# EAGLE design hendrikson_1_1 (EAGLE 8.4.3)
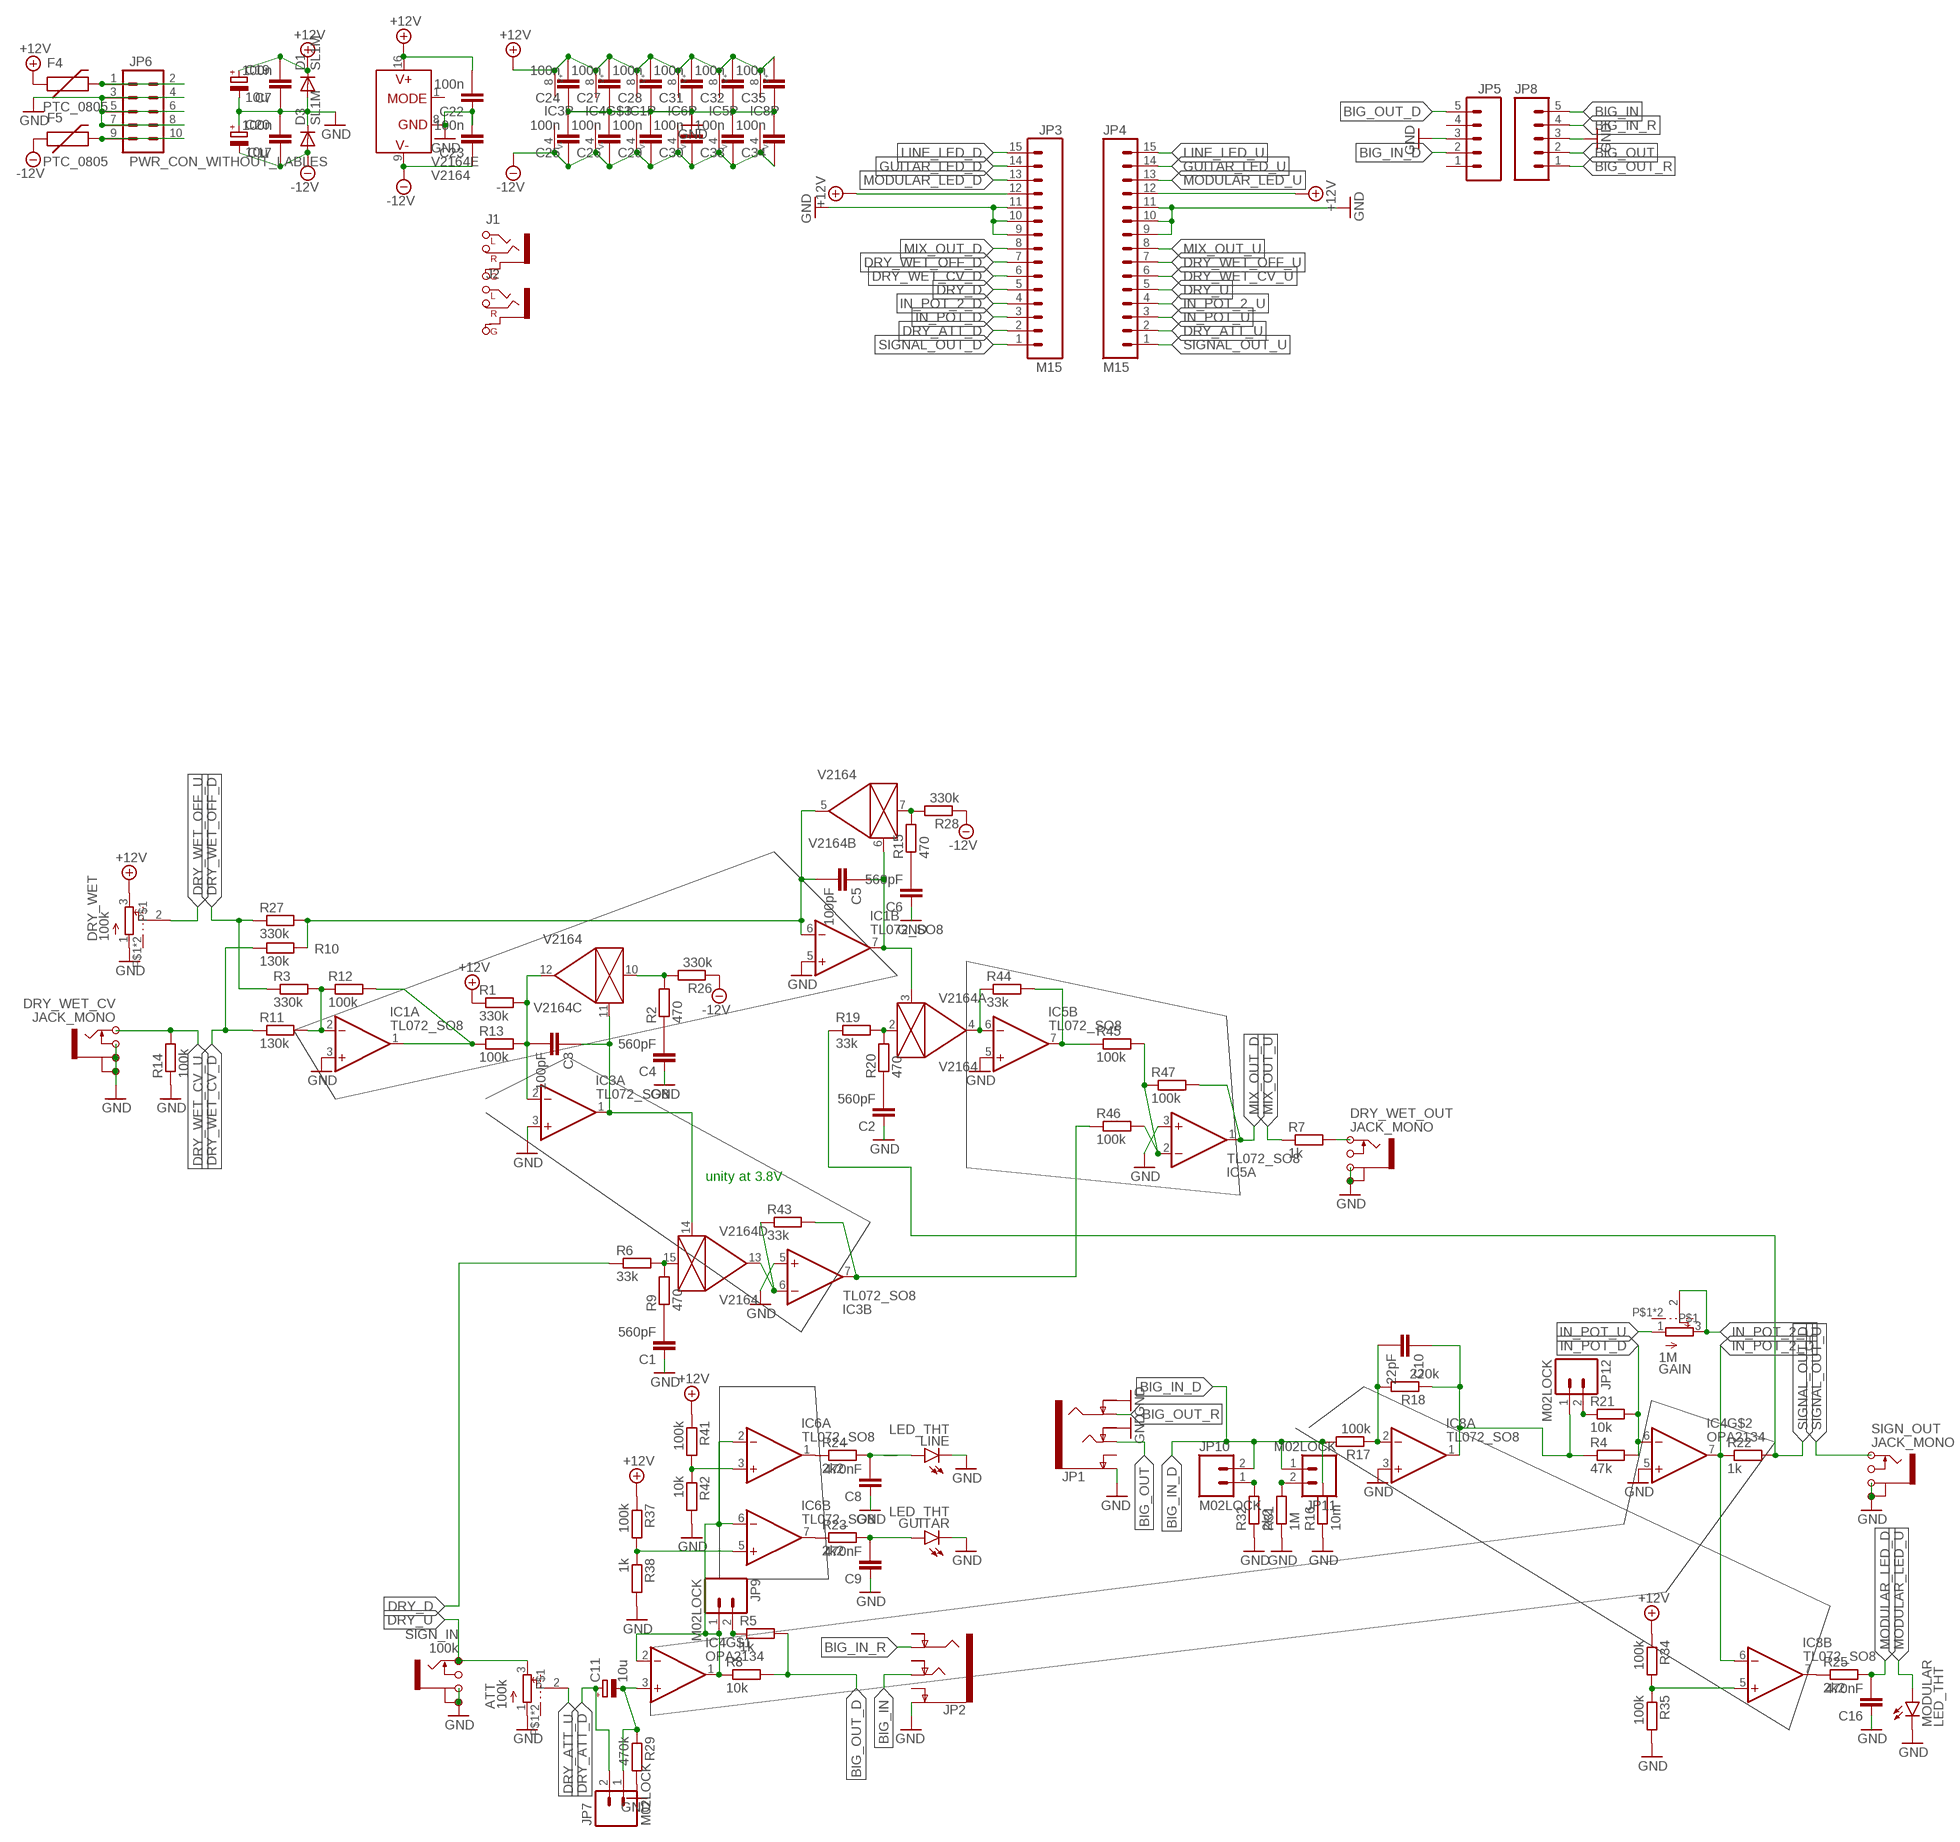
[diagram p0: schematic, sheet 1]

## Parts
ATT  100k  POT_ALPHA  [POT_ALPHA]
C1  560pF  CAPACITOR0603  [CAPACITOR0603]
C2  560pF  CAPACITOR0603  [CAPACITOR0603]
C3  100pF  CAPACITOR0603  [CAPACITOR0603]
C4  560pF  CAPACITOR0603  [CAPACITOR0603]
C5  100pF  CAPACITOR0603  [CAPACITOR0603]
C6  560pF  CAPACITOR0603  [CAPACITOR0603]
C7  100n  CAPACITOR0603  [CAPACITOR0603]
C8  470nF  CAPACITOR0603  [CAPACITOR0603]
C9  470nF  CAPACITOR0603  [CAPACITOR0603]
C10  22pF  CAPACITOR0603  [CAPACITOR0603]
C11  10u  CPOL_4MM  [CPOL_4MM]
C16  470nF  CAPACITOR0603  [CAPACITOR0603]
C17  100n  CAPACITOR0603  [CAPACITOR0603]
C19  10u  CPOL_4MM  [CPOL_4MM]
C20  10u  CPOL_4MM  [CPOL_4MM]
C22  100n  CAPACITOR0603  [CAPACITOR0603]
C23  100n  CAPACITOR0603  [CAPACITOR0603]
C24  100n  CAPACITOR0603  [CAPACITOR0603]
C25  100n  CAPACITOR0603  [CAPACITOR0603]
C26  100n  CAPACITOR0603  [CAPACITOR0603]
C27  100n  CAPACITOR0603  [CAPACITOR0603]
C28  100n  CAPACITOR0603  [CAPACITOR0603]
C29  100n  CAPACITOR0603  [CAPACITOR0603]
C30  100n  CAPACITOR0603  [CAPACITOR0603]
C31  100n  CAPACITOR0603  [CAPACITOR0603]
C32  100n  CAPACITOR0603  [CAPACITOR0603]
C33  100n  CAPACITOR0603  [CAPACITOR0603]
C34  100n  CAPACITOR0603  [CAPACITOR0603]
C35  100n  CAPACITOR0603  [CAPACITOR0603]
D1  SL1M  [SOD123]
D3  SL1M  [SOD123]
DRY_WET  100k  POT_ALPHA  [POT_ALPHA]
DRY_WET_CV  JACK_MONO  [JACK_MONO]
DRY_WET_OUT  JACK_MONO  [JACK_MONO]
F4  PTC_0805  [PTC0805]
F5  PTC_0805  [PTC0805]
GAIN  1M  POT_ALPHA  [POT_ALPHA]
GUITAR  LED_THT  [LEDSMALLHOLES]
IC1  TL072_SO8  [SO8]
IC3  TL072_SO8  [SO8]
IC4  OPA2134  [SO8]
IC5  TL072_SO8  [SO8]
IC6  TL072_SO8  [SO8]
IC8  TL072_SO8  [SO8]
J1  NEUTRIK_VERT_JACK_6.3MM  [RJ5VM]
J2  NEUTRIK_VERT_JACK_6.3MM  [RJ5VM]
JP1  SPARKFUN-CONNECTORS_AUDIO-JACK4-.25-HORIZ-TRS  [SPARKFUN-CONNECTORS_AUDIO-JACK-.25-INCH-HORIZ-PTH]
JP2  SPARKFUN-CONNECTORS_AUDIO-JACK4-.25-HORIZ-TRS  [SPARKFUN-CONNECTORS_AUDIO-JACK-.25-INCH-HORIZ-PTH]
JP3  M15  [1X15]
JP4  M15  [1X15]
JP5  M05PTH  [1X05]
JP6  PWR_CON_WITHOUT_LABLES  [PWR_CON_WITHOUT_LABLES]
JP7  M02LOCK  [1X02_LOCK]
JP8  M05PTH_LONGPADS  [1X05_LONGPADS]
JP9  M02LOCK  [1X02_LOCK]
JP10  M02LOCK  [1X02_LOCK]
JP11  M02LOCK  [1X02_LOCK]
JP12  M02LOCK  [1X02_LOCK]
LINE  LED_THT  [LEDSMALLHOLES]
MODULAR  LED_THT  [LEDSMALLHOLES]
R1  330k  RESISTOR0603  [RESISTOR0603]
R2  470  RESISTOR0603  [RESISTOR0603]
R3  330k  RESISTOR0603  [RESISTOR0603]
R4  47k  RESISTOR0603  [RESISTOR0603]
R5  1k  RESISTOR0603  [RESISTOR0603]
R6  33k  RESISTOR0603  [RESISTOR0603]
R7  1k  RESISTOR0603  [RESISTOR0603]
R8  10k  RESISTOR0603  [RESISTOR0603]
R9  470  RESISTOR0603  [RESISTOR0603]
R10  130k  RESISTOR0603  [RESISTOR0603]
R11  130k  RESISTOR0603  [RESISTOR0603]
R12  100k  RESISTOR0603  [RESISTOR0603]
R13  100k  RESISTOR0603  [RESISTOR0603]
R14  100k  RESISTOR0603  [RESISTOR0603]
R15  470  RESISTOR0603  [RESISTOR0603]
R16  10m  RESISTOR0603  [RESISTOR0603]
R17  100k  RESISTOR0603  [RESISTOR0603]
R18  220k  RESISTOR0603  [RESISTOR0603]
R19  33k  RESISTOR0603  [RESISTOR0603]
R20  470  RESISTOR0603  [RESISTOR0603]
R21  10k  RESISTOR0603  [RESISTOR0603]
R22  1k  RESISTOR0603  [RESISTOR0603]
R23  2k2  RESISTOR0603  [RESISTOR0603]
R24  2k2  RESISTOR0603  [RESISTOR0603]
R25  2k2  RESISTOR0603  [RESISTOR0603]
R26  330k  RESISTOR0603  [RESISTOR0603]
R27  330k  RESISTOR0603  [RESISTOR0603]
R28  330k  RESISTOR0603  [RESISTOR0603]
R29  470k  RESISTOR0603  [RESISTOR0603]
R31  1M  RESISTOR0603  [RESISTOR0603]
R32  2k2  RESISTOR0603  [RESISTOR0603]
R34  100k  RESISTOR0603  [RESISTOR0603]
R35  100k  RESISTOR0603  [RESISTOR0603]
R37  100k  RESISTOR0603  [RESISTOR0603]
R38  1k  RESISTOR0603  [RESISTOR0603]
R41  100k  RESISTOR0603  [RESISTOR0603]
R42  10k  RESISTOR0603  [RESISTOR0603]
R43  33k  RESISTOR0603  [RESISTOR0603]
R44  33k  RESISTOR0603  [RESISTOR0603]
R45  100k  RESISTOR0603  [RESISTOR0603]
R46  100k  RESISTOR0603  [RESISTOR0603]
R47  100k  RESISTOR0603  [RESISTOR0603]
SIGN_IN  100k  JACK_MONO  [JACK_MONO]
SIGN_OUT  JACK_MONO  [JACK_MONO]
V2164  V2164  SSM2164  [SO16]

## Nets
+12V: C7.2 C19.+ C22.2 C24.2 C27.2 C28.2 C31.2 C32.2 C35.2 D1.C DRY_WET.3 F4.2 IC1.8(P:V+) IC3.8(P:V+) IC4.8(V+) IC5.8(P:V+) IC6.8(P:V+) IC8.8(P:V+) JP3.12 JP4.12 R1.1 R34.1 R37.1 R41.1 V2164.16(E:V+)
-12V: C17.1 C20.- C23.1 C25.1 C26.1 C29.1 C30.1 C33.1 C34.1 D3.A F5.2 IC1.4(P:V-) IC3.4(P:V-) IC4.4(V-) IC5.4(P:V-) IC6.4(P:V-) IC8.4(P:V-) R26.1 R28.1 V2164.9(E:V-)
BIG_IN: JP2.P$6(TIP) JP8.5
BIG_IN_D: JP5.2 JP10.2 JP11.1 R16.2 R17.2
BIG_IN_R: JP2.P$4(RING) JP8.4
BIG_OUT: JP1.P$6(TIP) JP8.2
BIG_OUT_D: JP5.5 R5.2 R8.2
BIG_OUT_R: JP1.P$4(RING) JP8.1
DRY_ATT_D: C11.+ JP3.2 JP7.2
DRY_ATT_U: ATT.2 JP4.2
DRY_D: JP3.5 R6.1
DRY_U: ATT.3 JP4.5 SIGN_IN.T
DRY_WET_CV_D: JP3.6 R10.1 R11.1
DRY_WET_CV_U: DRY_WET_CV.T JP4.6 R14.2
DRY_WET_OFF_D: JP3.7 R3.1 R27.1
DRY_WET_OFF_U: DRY_WET.2 JP4.7
GND: ATT.1 C1.1 C2.1 C4.1 C6.1 C7.1 C8.1 C9.1 C16.1 C17.2 C19.- C20.+ C22.1 C23.2 C24.1 C25.2 C26.2 C27.1 C28.1 C29.2 C30.2 C31.1 C32.1 C33.2 C34.2 C35.1 D1.A D3.C DRY_WET.1 DRY_WET_CV.G1 DRY_WET_CV.G2 DRY_WET_CV.SW DRY_WET_OUT.G1 DRY_WET_OUT.G2 GUITAR.K(C) IC1.3(A:+IN) IC1.5(B:+IN) IC3.3(A:+IN) IC3.5(B:+IN) IC4.5(+IN) IC5.3(A:+IN) IC5.5(B:+IN) IC8.3(A:+IN) JP1.P$2(EARTH) JP1.P$5(RING-NORM) JP1.P$7(TIP-NORM) JP2.P$2(EARTH) JP3.9 JP3.10 JP3.11 JP4.9 JP4.10 JP4.11 JP5.3 JP6.3 JP6.4 JP6.5 JP6.6 JP6.7 JP6.8 JP8.3 LINE.K(C) MODULAR.K(C) R14.1 R16.1 R29.2 R31.1 R32.1 R35.2 R38.2 R42.2 SIGN_IN.G1 SIGN_IN.G2 SIGN_OUT.G1 SIGN_OUT.G2 V2164.8(E:GND)
GUITAR_LED_D: JP3.14
GUITAR_LED_U: C9.2 GUITAR.A JP4.14 R23.2
IN_POT_2_D: IC4.7(OUT) IC8.6(B:-IN) JP3.4 R22.1
IN_POT_2_U: GAIN.2 GAIN.3 JP4.4
IN_POT_D: IC4.6(-IN) JP3.3 R4.2 R21.2
IN_POT_U: GAIN.1 JP4.3
LINE_LED_D: JP3.15
LINE_LED_U: C8.2 JP4.15 LINE.A R24.2
MIX_OUT_D: IC5.1(A:OUT) JP3.8 R47.2
MIX_OUT_U: JP4.8 R7.1
MODULAR_LED_D: C16.2 JP3.13 R25.2
MODULAR_LED_U: JP4.13 MODULAR.A
N$1: IC6.1(A:OUT) R24.1
N$2: IC8.7(B:OUT) R25.1
N$3: IC1.1(A:OUT) R12.2 R13.1
N$4: C4.2 R2.1
N$5: IC6.7(B:OUT) R23.1
N$6: C3.1 IC3.1(A:OUT) V2164.11(C:CTRL) V2164.14(D:CTRL)
N$7: C11.- IC4.3(+IN) JP7.1 R29.1
N$8: JP12.2 R21.1
N$9: IC4.1(OUT) IC4.2(-IN) IC6.2(A:-IN) IC6.6(B:-IN) JP9.1 R8.1
N$11: R6.2 R9.2 V2164.15(D:IN)
N$13: C1.2 R9.1
N$16: IC3.6(B:-IN) R43.1 V2164.13(D:OUT)
N$17: IC3.7(B:OUT) R43.2 R46.1
N$18: IC5.7(B:OUT) R44.2 R45.1
N$19: IC5.6(B:-IN) R44.1 V2164.4(A:OUT)
N$20: C5.1 IC1.7(B:OUT) V2164.3(A:CTRL) V2164.6(B:CTRL)
N$21: R15.2 R28.2 V2164.7(B:IN)
N$22: IC5.2(A:-IN) R45.2 R46.2 R47.1
N$24: C10.2 IC8.2(A:-IN) R17.1 R18.2
N$26: R19.2 R20.2 V2164.2(A:IN)
N$27: C2.2 R20.1
N$31: JP9.2 R5.1
N$32: DRY_WET_OUT.T R7.2
N$34: R2.2 R26.2 V2164.10(C:IN)
N$35: IC1.2(A:-IN) R3.2 R11.2 R12.1
N$36: C6.2 R15.1
N$38: IC8.5(B:+IN) R34.2 R35.1
N$40: JP10.1 R32.2
N$41: JP11.2 R31.2
N$44: F4.3 JP6.1 JP6.2
N$45: F5.3 JP6.9 JP6.10
N$48: IC6.5(B:+IN) R37.2 R38.1
N$53: IC6.3(A:+IN) R41.2 R42.1
SIGNAL_OUT_D: JP3.1 R19.1 R22.2
SIGNAL_OUT_U: JP4.1 SIGN_OUT.T
VCA_IN_SUM_D: C5.2 IC1.6(B:-IN) R10.2 R27.2 V2164.5(B:OUT)
VCA_OUT_SUM_D: C3.2 IC3.2(A:-IN) R1.2 R13.2 V2164.12(C:OUT)
WHATEVR: C10.1 IC8.1(A:OUT) JP12.1 R4.1 R18.1
Unconnected: ATT.P$1 ATT.P$2 DRY_WET.P$1 DRY_WET.P$2 DRY_WET_OUT.SW GAIN.P$1 GAIN.P$2 J1.R J1.S(G) J1.T(L) J2.R J2.S(G) J2.T(L) JP1.P$3(EARTH-NORM) JP2.P$3(EARTH-NORM) JP2.P$5(RING-NORM) JP2.P$7(TIP-NORM) JP5.1 JP5.4 SIGN_IN.SW SIGN_OUT.SW V2164.1(E:MODE)

## Notes on the sheet
- unity at 3.8V

## Library data of the parts
ATT DRY_WET GAIN = BASTL_POTS:POT_ALPHA
C1-C10 C16 C17 C22-C35 = BASTL_CAPACITORS:CAPACITOR0603
C11 C19 C20 = BASTL_CAPACITORS:CPOL_4MM
D1 D3 = BASTL_DIODES:SL1M: diode instead of 1N4007
DRY_WET_CV DRY_WET_OUT SIGN_IN SIGN_OUT = BASTL_CONNECTORS:JACK_MONO
F4 F5 = BASTL_FUSES:PTC_0805
GUITAR LINE MODULAR = BASTL_LEDS:LED_THT
IC1 IC3 IC5 IC6 IC8 = BASTL_ICS:TL072_SO8
IC4 = BASTL_ICS:OPA2134
J1 J2 = BASTL_CONNECTORS:NEUTRIK_VERT_JACK_6.3MM
JP1 JP2 = BASTL_CONNECTORS:SPARKFUN-CONNECTORS_AUDIO-JACK4-.25-HORIZ-TRS: 1/4" TRS jack, horizontal Production SKU: COM-11144 Footprint unproven - datasheet and part seem to be slightly different; PROD_ID: COM-11144
JP3 JP4 = SparkFun-Connectors:M15: Header 15 Standard 15-pin 0.1" header. Use with straight break away headers (SKU : PRT-00116), right angle break away headers (PRT-00553), swiss pins (PRT-00743), machine pins (PRT-00117), and female headers (PRT-00115).
JP5 JP8 = SparkFun-Connectors:M05: Header 5 Standard 5-pin 0.1" header. Use with straight break away headers (SKU : PRT-00116), right angle break away headers (PRT-00553), swiss pins (PRT-00743), machine pins (PRT-00117), and female headers (PRT-00115). Molex polarized connector foot print use with SKU : PRT-08230 with associated crimp pins and housings.
JP6 = BASTL_CONNECTORS:PWR_CON_WITHOUT_LABLES
JP7 JP9-JP12 = BASTL_PINHEADERS:M02: Standard 2-pin 0.1" header. Use with - straight break away headers ( PRT-00116) - right angle break away headers (PRT-00553) - swiss pins (PRT-00743) - machine pins (PRT-00117) - female headers (PRT-00115) Molex polarized connector foot print use with: PRT-08233 with associated crimp pins and housings. 2.54_SCREWTERM for use with PRT-10571. 3.5mm Screw Terminal footprints for PRT-08084 5mm Screw Terminal footprints for use with PRT-08433
R1-R29 R31 R32 R34 R35 R37 R38 R41-R47 = BASTL_RESISTORS:RESISTOR0603
V2164 = BASTL_ICS:SSM2164

## Board
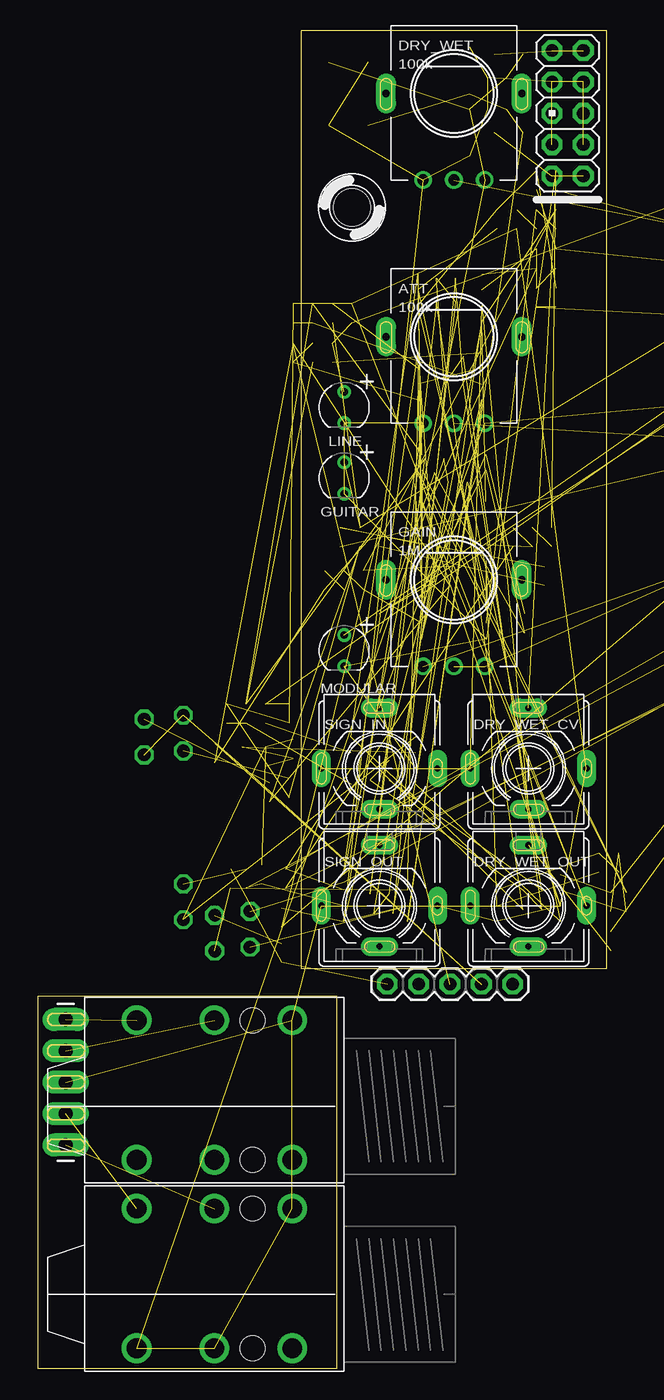
[diagram p1: board, top side]
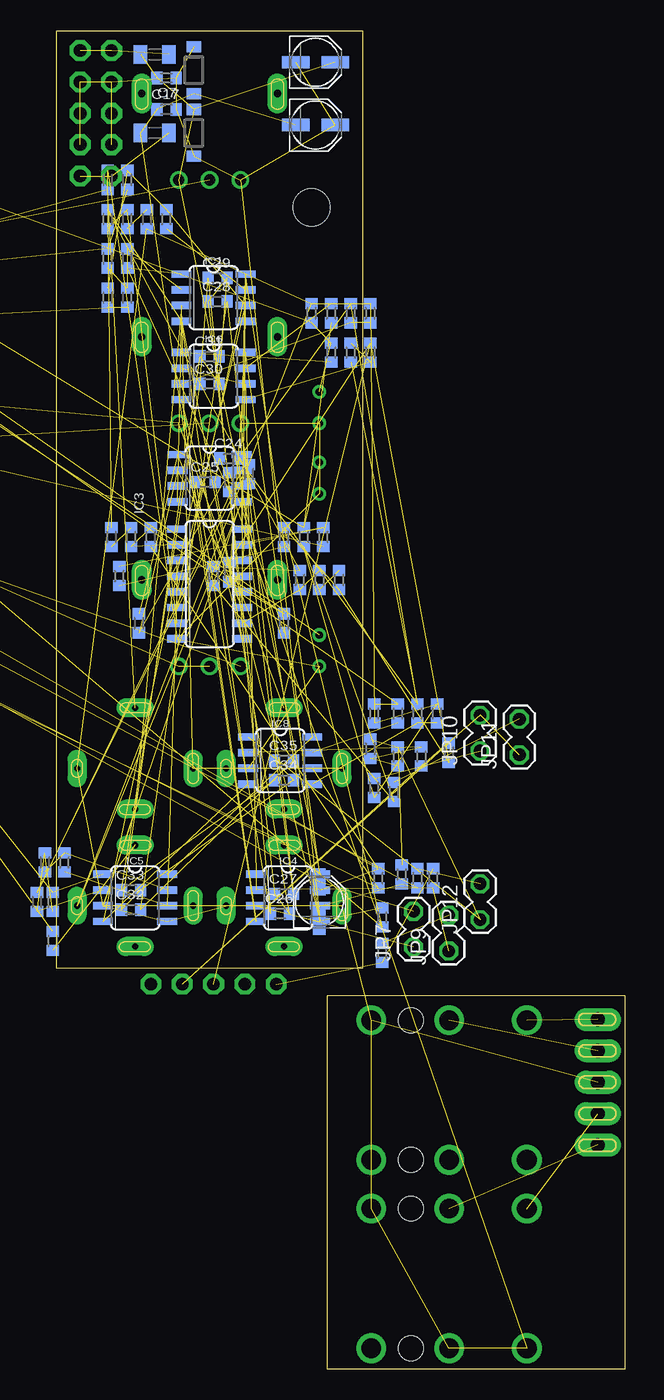
[diagram p2: board, bottom side, seen from below]

Size 46.04 x 108.27 mm. Coordinates in mm from the lower left corner, seen from the top.
Outline: 46.04,32.39 46.04,108.27 21.27,108.27 21.27,32.39 46.04,32.39
Outline: 24.13,0 0,0 0,30.16 24.13,30.16 24.13,0
Copper layers (1*16): Top 0.035mm / dielectric 1.5mm / Bottom 0.035mm
Design rules "default": minimum track width 10mil, minimum drill 24mil, track to track 8mil, track to pad 8mil, pad to pad 8mil, via to via 8mil, smd to smd 8mil, copper to edge 40mil, drill to drill 8mil, minimum pad ring 10mil, minimum via ring 8mil, stop-mask expansion 4mil, vias tented up to drill 0mil, thermal gap 10mil

### Footprints (pad centres in the part's own frame; a part is rotated, then mirrored left to right if it is on the bottom)
POT_ALPHA = drill 0.9 pad 1.422: 1 -2.5,0; 2 0,0; 3 2.5,0 | drill 0.6 pad 1.6 long: P$1 -5.5,7; P$2 5.5,7
CAPACITOR0603 = smd 0.9 x 1: 1 -0.771,0; 2 0.771,0
CPOL_4MM = smd 2.2 x 1: + 1.6,0; - -1.6,0
SOD123 = smd 0.9 x 1.2: A 1.9,0; C -1.9,0
JACK_MONO = drill 0.5 pad 1.524 long: G1 -4.7,0; G2 4.7,0; SW 0,-3.3; T 0,4.9
PTC0805 = smd 1.1 x 1.5: 2 1.15,0; 3 -1.15,0
LEDSMALLHOLES = drill 0.6: A -1.27,0; K 1.27,0
SO8 = smd 1.6 x 0.6: 1 -2.6,1.905; 2 -2.6,0.635; 3 -2.6,-0.635; 4 -2.6,-1.905; 5 2.6,-1.905; 6 2.6,-0.635; 7 2.6,0.635; 8 2.6,1.905
RJ5VM = drill 0.7 pad 1.422 long: R 0.5,6.5; S 4.5,-4.5; T -6.5,-0.5
SPARKFUN-CONNECTORS_AUDIO-JACK-.25-INCH-HORIZ-PTH = drill 1.6: P$2 4.2,-6.92; P$3 4.2,4.38; P$4 10.5,-6.92; P$5 10.5,4.38; P$6 16.8,-6.92; P$7 16.8,4.38 | hole 2: 7.4,4.38; 7.4,-6.92
1X15 = drill 1.016 pad 1.676 octagon: 1 0,0; 2 2.54,0; 3 5.08,0; 4 7.62,0; 5 10.16,0; 6 12.7,0; 7 15.24,0; 8 17.78,0; 9 20.32,0; 10 22.86,0; 11 25.4,0; 12 27.94,0; 13 30.48,0; 14 33.02,0; 15 35.56,0
1X05 = drill 1.016 pad 1.676 octagon: 1 0,0; 2 2.54,0; 3 5.08,0; 4 7.62,0; 5 10.16,0
PWR_CON_WITHOUT_LABLES = drill 1.016 pad 1.676 octagon: 1 -1.27,5.08; 2 1.27,5.08; 3 -1.27,2.54; 4 1.27,2.54; 5 -1.27,0; 6 1.27,0; 7 -1.27,-2.54; 8 1.27,-2.54; 9 -1.27,-5.08; 10 1.27,-5.08
1X02_LOCK = drill 1.016 octagon: 1 -0.178,0; 2 2.718,0
1X05_LONGPADS = drill 1.118 pad 1.88 long: 1 0,0; 2 2.54,0; 3 5.08,0; 4 7.62,0; 5 10.16,0
RESISTOR0603 = smd 0.9 x 1: 1 -0.771,0; 2 0.771,0
3MM_HOLE = hole 3: 0,0
SO16 = smd 0.6 x 1.6: 1 -4.445,-2.635; 2 -3.175,-2.635; 3 -1.905,-2.635; 4 -0.635,-2.635; 5 0.635,-2.635; 6 1.905,-2.635; 7 3.175,-2.635; 8 4.445,-2.635; 9 4.445,2.635; 10 3.175,2.635; 11 1.905,2.635; 12 0.635,2.635; 13 -0.635,2.635; 14 -1.905,2.635; 15 -3.175,2.635; 16 -4.445,2.635

### Placement (x,y rotation side)
ATT  33.66,76.52 0 top
C1  27.62,67.31 270 bottom
C2  41.59,67.31 270 bottom
C3  39.37,60.33 270 bottom
C4  23.18,63.82 90 bottom
C5  37.15,93.03 90 bottom
C6  38.73,93.03 90 bottom
C7  37.15,104.46 180 bottom
C8  25.4,85.41 270 bottom
C9  26.04,67.31 90 bottom
C10  18.41,49.53 270 bottom
C11  24.77,37.78 90 bottom
C16  20.32,53.02 90 bottom
C17  37.15,101.92 0 bottom
C19  25.08,105.73 0 bottom
C20  25.08,100.65 0 bottom
C22  32.07,64.45 270 bottom
C23  33.34,64.14 270 bottom
C24  32.07,73.66 0 bottom
C25  33.97,71.75 0 bottom
C26  27.94,36.83 0 bottom
C27  27.62,38.42 0 bottom
C28  33.02,86.36 0 bottom
C29  33.02,88.27 0 bottom
C30  33.66,79.69 0 bottom
C31  33.66,81.91 0 bottom
C32  40.01,37.15 0 bottom
C33  40.01,38.73 0 bottom
C34  27.62,47.62 0 bottom
C35  27.62,49.21 0 bottom
D1  34.92,100.01 270 bottom
D3  34.92,105.09 270 bottom
DRY_WET  33.66,96.2 0 top
DRY_WET_CV  39.69,48.58 0 top
DRY_WET_OUT  39.69,37.47 0 top
F4  38.1,106.36 180 bottom
F5  38.1,100.01 180 bottom
GAIN  33.66,56.83 0 top
GUITAR  24.77,72.07 270 top
IC1  33.34,86.68 0 bottom
IC3  33.66,72.07 0 bottom
IC4  27.3,38.1 0 bottom
IC5  39.69,38.1 0 bottom
IC6  33.34,80.33 0 bottom
IC8  27.94,49.21 0 bottom
J1  26.04,-30.16 255 top  (outside the outline)
J2  45.4,-27.62 255 top  (outside the outline)
JP1  24.77,6.03 180 top
JP2  24.77,21.27 180 top
JP3  86.04,70.8 90 top  (outside the outline)
JP4  84.77,70.8 90 top  (outside the outline)
JP5  38.42,31.11 180 top
JP6  42.86,101.6 0 top
JP7  17.14,34.29 90 bottom
JP8  2.22,18.1 90 top
JP9  14.29,33.97 90 bottom
JP10  11.75,50.16 90 bottom
JP11  8.57,49.85 90 bottom
JP12  11.75,36.51 90 bottom
LINE  24.77,77.79 270 top
MODULAR  24.77,58.1 270 top
R1  27.62,60.33 270 bottom
R2  24.77,63.82 90 bottom
R3  41.91,89.85 270 bottom
R4  18.1,40.01 270 bottom
R5  19.69,33.66 270 bottom
R6  24.45,67.31 90 bottom
R7  46.36,34.61 270 bottom
R8  15.56,39.69 90 bottom
R9  40.96,64.14 90 bottom
R10  41.91,86.68 90 bottom
R11  40.32,86.68 90 bottom
R12  40.32,89.85 270 bottom
R13  32.07,71.75 90 bottom
R14  41.91,96.2 270 bottom
R15  40.32,93.03 90 bottom
R16  14.29,49.85 90 bottom
R17  16.51,49.53 270 bottom
R18  20.64,50.16 270 bottom
R19  38.42,67.31 90 bottom
R20  40.01,67.31 270 bottom
R21  16.83,39.69 270 bottom
R22  20,39.69 270 bottom
R23  23.81,85.41 270 bottom
R24  23.81,82.23 90 bottom
R25  18.41,53.02 90 bottom
R26  26.35,63.82 270 bottom
R27  40.32,96.2 90 bottom
R28  41.91,93.03 270 bottom
R29  19.69,36.51 270 bottom
R31  18.73,46.67 90 bottom
R32  20.32,46.99 90 bottom
R34  16.83,53.02 270 bottom
R35  15.24,53.02 90 bottom
R37  22.23,82.23 90 bottom
R38  20.64,82.23 90 bottom
R41  22.23,85.41 270 bottom
R42  20.64,85.41 90 bottom
R43  30.48,72.39 90 bottom
R44  45.4,40.96 90 bottom
R45  46.99,40.96 90 bottom
R46  47.62,37.78 270 bottom
R47  46.36,37.78 90 bottom
SIGN_IN  27.62,48.58 0 top
SIGN_OUT  27.62,37.47 0 top
U$1  [3MM_HOLE]  25.4,93.98 0 top
V2164  33.66,63.5 270 bottom

### Tracks (layer width: path | path; a pad name or v marks a point on that pad's centre or on a via)
+12V  (24 unrouted)
-12V  (19 unrouted)
BIG_IN  (1 unrouted)
BIG_IN_D  (4 unrouted)
BIG_IN_R  (1 unrouted)
BIG_OUT  (1 unrouted)
BIG_OUT_D  (2 unrouted)
BIG_OUT_R  (1 unrouted)
DRY_ATT_D  (2 unrouted)
DRY_ATT_U  (1 unrouted)
DRY_D  (1 unrouted)
DRY_U  (2 unrouted)
DRY_WET_CV_D  (2 unrouted)
DRY_WET_CV_U  (2 unrouted)
DRY_WET_OFF_D  (2 unrouted)
DRY_WET_OFF_U  (1 unrouted)
GND  (75 unrouted)
  pour Top: 90.17,-9.52 124.14,-8.89 124.14,110.81 87,110.81 89.22,29.53 88.9,30.16 88.9,-9.21
  pour Bottom: 85.72,-6.67 134.94,-9.52 134.94,107.31 92.07,110.81 95.57,36.51 85.72,35.24
GUITAR_LED_U  (3 unrouted)
IN_POT_2_D  (3 unrouted)
IN_POT_2_U  (2 unrouted)
IN_POT_D  (3 unrouted)
IN_POT_U  (1 unrouted)
LINE_LED_U  (3 unrouted)
MIX_OUT_D  (2 unrouted)
MIX_OUT_U  (1 unrouted)
MODULAR_LED_D  (2 unrouted)
MODULAR_LED_U  (1 unrouted)
N$1  (1 unrouted)
N$2  (1 unrouted)
N$3  (2 unrouted)
N$4  (1 unrouted)
N$5  (1 unrouted)
N$6  (3 unrouted)
N$7  (3 unrouted)
N$8  (1 unrouted)
N$9  (5 unrouted)
N$11  (2 unrouted)
N$13  (1 unrouted)
N$16  (2 unrouted)
N$17  (2 unrouted)
N$18  (2 unrouted)
N$19  (2 unrouted)
N$20  (3 unrouted)
N$21  (2 unrouted)
N$22  (3 unrouted)
N$24  (3 unrouted)
N$26  (2 unrouted)
N$27  (1 unrouted)
N$31  (1 unrouted)
N$32  (1 unrouted)
N$34  (2 unrouted)
N$35  (3 unrouted)
N$36  (1 unrouted)
N$38  (2 unrouted)
N$40  (1 unrouted)
N$41  (1 unrouted)
N$44  (2 unrouted)
N$45  (2 unrouted)
N$48  (2 unrouted)
N$53  (2 unrouted)
SIGNAL_OUT_D  (2 unrouted)
SIGNAL_OUT_U  (1 unrouted)
VCA_IN_SUM_D  (4 unrouted)
VCA_OUT_SUM_D  (4 unrouted)
WHATEVR  (4 unrouted)